# Altium schematic sheet Sheet1.SchDoc: Amegapad
size A; DrawnBy: Matt Harlum; Engineer: Matt Harlum; DocumentNumber: 1; Revision: A; SheetNumber: 1; SheetTotal: 1; PageSetup: Record=PageOptions|CenterHorizontal=True|CenterVertical=True|PrintScale=1.00|XCorrection=1.00|YCorrection=1.00|PrintKind=0|BorderSize=5000000|LeftOffset=0|BottomOffset=0|Orientation=2|PaperLength=1000|PaperWidth=1000|Scale=100|PaperSource=7|PrintQuality=-3|MediaType=1|DitherType=10|PrintScaleMode=1|PaperKind=A4|PaperIndex=9; ProjectName: Amegapad
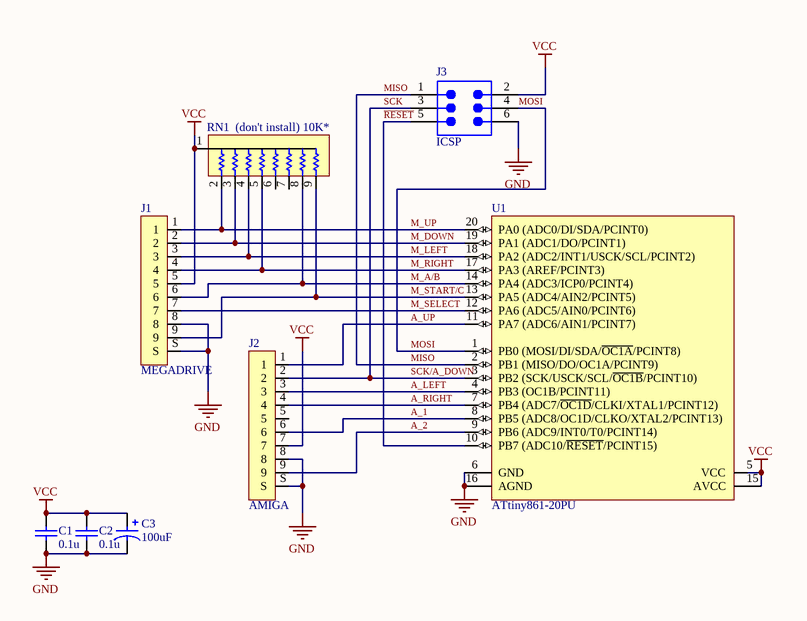
[diagram p0: Sheet1.SchDoc]

## Parts
C1  0.1u  [PCB-gb6o2snpw67z713rrl5r-1]
C2  0.1u  [PCB-gb6o2snpw67z713rrl5r-1]
C3  100uF  [PCB-zkzjfh55ek2i5yq9ppya-1]
J1  MEGADRIVE  [PCB-narckcn0kuokny0s6axh-1]
J2  AMIGA  [PCB-x3gdmgk5yw5hhg2skuh0-1]
J3  ICSP  [2X03]
RN1  10K*  [PCB-tw4qvmihfhj6qswmfh4l-1]
U1  ATtiny861-20PU  [20P3]

## Nets
GND: C1.1 C2.1 C3.2 J1.8 J1.S J2.8 J2.S J3.6 U1.6(GND) U1.16(AGND)
VCC: C1.2 C2.2 C3.1 J1.5 J2.7 J3.2 RN1.1 U1.5(VCC) U1.15(AVCC)
A_1: J2.6 U1.8(PB5_(ADC8/OC1D/CLKO/XTAL2/PCINT13))
A_2: J2.9 U1.9(PB6_(ADC9/INT0/T0/PCINT14))
A_LEFT: J2.3 U1.4(PB3_(OC1B/PCINT11))
A_RIGHT: J2.4 U1.7(PB4_(ADC7/~{OC1D}/CLKI/XTAL1/PCINT12))
A_UP: J2.1 U1.11(PA7_(ADC6/AIN1/PCINT7))
M_A/B: J1.6 RN1.8 U1.14(PA4_(ADC3/ICP0/PCINT4))
M_DOWN: J1.2 RN1.3 U1.19(PA1_(ADC1/DO/PCINT1))
M_LEFT: J1.3 RN1.4 U1.18(PA2_(ADC2/INT1/USCK/SCL/PCINT2))
M_RIGHT: J1.4 RN1.5 U1.17(PA3_(AREF/PCINT3))
M_SELECT: J1.7 U1.12(PA6_(ADC5/AIN0/PCINT6))
M_START/C: J1.9 RN1.9 U1.13(PA5_(ADC4/AIN2/PCINT5))
M_UP: J1.1 RN1.2 U1.20(PA0_(ADC0/DI/SDA/PCINT0))
MISO: J3.1 U1.2(PB1_(MISO/DO/OC1A/PCINT9))
MOSI: J3.4 U1.1(PB0_(MOSI/DI/SDA/~{OC1A}/PCINT8))
~{RESET}: J3.5 U1.10(PB7_(ADC10/~{RESET}/PCINT15))
SCK: J2.2 J3.3 U1.3(PB2_(SCK/USCK/SCL/~{OC1B}/PCINT10))  [also labelled SCK/A_DOWN]

Not connected (* = marked no-connect by the designer): J2 5; RN1 6 7

## Notes on the sheet
- (near RN1) (don't install)
- Title
- Size:
- Date:
- A
- Number:
- Time:
- Revision:
- Sheet
- of
- File:

## Library data of the parts
C1 C2 = CMP-mck1uwszlh1jwp1a4juu-2: Generic Ceramic capacitor; CustomComponentID: mck1uwszlh1jwp1a4juu
C3 = CMP-2ourdj6tgxzh24x23r42-1: Electrolytic capacitor, 2.5mm lead spacing; CustomComponentID: 2ourdj6tgxzh24x23r42
J1 = CMP-zxqw2vts6hu4resmcbpc-3: D-Sub 9 Male Right angle
J2 = CMP-et3ztss3jq69ayfxonkj-2: D-Sub 9 Female - Right angle; CustomComponentID: et3ztss3jq69ayfxonkj
J3 = CMP-664156-9: TE Connectivity AMPMODU Series, 2.54mm Pitch 6 Way 2 Row Straight PCB Header, Solder Termination, 3A; Manufacturer Part Number: 826656-3; CiivaID: 664156; Pitch: 0.100" (2.54mm); Connector Type: Header, Unshrouded, Breakaway; Number of Positions: 6; 3D Model: 826656-3.pdf; Number of Positions Loaded: All; RoHS Information: 826656-3 Statement of Compliance; Series: AMPMODU Mod II; Contact Finish Thickness: 31.5µin (0.80µm); Number of Rows: 2; Standard Package: 3,024; Termination: Solder; Contact Type: Male Pin; Packaging: Bulk; Row Spacing: 0.100" (2.54mm); Color: Green; Contact Finish: Gold; Family: Rectangular Connectors - Headers, Male Pins; Mounting Type: Through Hole; Ciiva URL: https://ciiva.com/part/826656-3-664156; Contact Mating Length: 0.228" (5.80mm); Category: Connectors, Interconnects
RN1 = CMP-ho91cd316paqm6me0i9o-1: 8 resistor (9 pin) bussed resistor network; CustomComponentID: ho91cd316paqm6me0i9o
U1 = CMP-2386869-3: 8-bit AVR Microcontroller, 2.7-5.5V, 20MHz, 8KB Flash, 512 Bytes EEPROM, 512 Bytes SRAM, 20-pin PDIP, Industrial Grade (-40°C to 85°C); Access Time: 2e-05 s; Clock Speed: 20000000.0 Hz; FLASH Memory Size: 8192 B; Lead-Free Status: Lead Free; Number of Bits: 8; Number of I/O Pins: 16; RAM Memory Size: 512 B; Supply Voltage (DC): 5.0 V; Case/Package: DIP; Core Architecture: AVR; Mounting Style: Through Hole; Number of Pins: 20; Octopart Url: https://octopart.com/attiny861-20pu-atmel-39622145; OctopartID: 25b2eee496d5fa75; Packaging: Tube; REACH SVHC Compliance: No SVHC; RoHS: Compliant